# Altium schematic sheet Bluetooth.SchDoc
size A
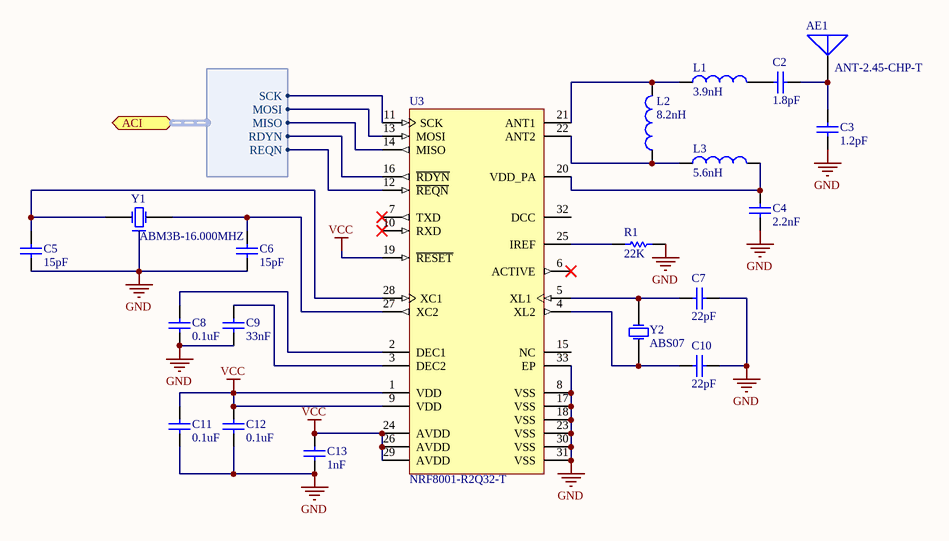
[diagram p0: Bluetooth.SchDoc]

## Parts
AE1  ANT-2.45-CHP-T  [ANT-2.45-CHP]
C2  value 1.8pF  [C0402[1005X55]]  (hidden comment: 1.8pF 50V 0402)
C3  value 1.2pF  [C0402[1005X55]]  (hidden comment: 1.2pF 50V 0402)
C4  value 2.2nF  [C0402[1005X55]]  (hidden comment: 2.2nF 50V 0402)
C5  value 15pF  [C0402[1005X55]]  (hidden comment: 15pF 50V 0402)
C6  value 15pF  [C0402[1005X55]]  (hidden comment: 15pF 50V 0402)
C7  value 22pF  [C0402[1005X55]]  (hidden comment: 22pF 50V 0402)
C8  value 0.1uF  [C0402[1005X55]]  (hidden comment: 0.1uF 6.3V 0402)
C9  value 33nF  [C0402[1005X55]]  (hidden comment: 33nF 50V 0402)
C10  value 22pF  [C0402[1005X55]]  (hidden comment: 22pF 50V 0402)
C11  value 0.1uF  [C0402[1005X55]]  (hidden comment: 0.1uF 6.3V 0402)
C12  value 0.1uF  [C0402[1005X55]]  (hidden comment: 0.1uF 6.3V 0402)
C13  value 1nF  [C0402[1005X55]]  (hidden comment: 1nF 50V 0402)
L1  3.9nH  [IND0402]
L2  8.2nH  [IND0402]
L3  5.6nH  [IND0402]
R1  value 22K  [R0402[1005]]  (hidden comment: 22K 1% 0402)
U3  NRF8001-R2Q32-T  [NRSC-QFN-32_M]
Y1  ABM3B-16.000MHZ  [ABRA-ABM3B-4_V]
Y2  ABS07  [ABS07]

## Ports
ACI (harness ACI)

## Harnesses
ACI: SCK, MISO, MOSI, RDYN, REQN

## Nets
GND: C3.1 C4.1 C5.1 C6.1 C7.2 C8.1 C9.1 C10.2 C11.1 C12.1 C13.1 R1.1 U3.8(VSS) U3.17(VSS) U3.18(VSS) U3.23(VSS) U3.30(VSS) U3.31(VSS) U3.33(EP) Y1.2
VCC: C11.2 C12.2 C13.2 U3.1(VDD) U3.9(VDD) U3.19(~{RESET}) U3.24(AVDD) U3.26(AVDD) U3.29(AVDD)
NetAE1_1: AE1.1 C2.2 C3.2
NetC2_1: C2.1 L1.2
NetC4_2: C4.2 L3.2 U3.20(VDD_PA)
NetC5_2: C5.2 U3.28(XC1) Y1.1(X1)
NetC6_2: C6.2 U3.27(XC2) Y1.3(X2)
NetC7_1: C7.1 U3.5(XL1) Y2.2(X2)
NetC8_2: C8.2 U3.2(DEC1)
NetC9_2: C9.2 U3.3(DEC2)
NetC10_1: C10.1 U3.4(XL2) Y2.1(X1)
NetL1_1: L1.1 L2.2 U3.21(ANT1)
NetL2_1: L2.1 L3.1 U3.22(ANT2)
NetR1_2: R1.2 U3.25(IREF)
NetU3_11: U3.11(SCK) ; port ACI.SCK
NetU3_12: U3.12(~{REQN}) ; port ACI.REQN
NetU3_13: U3.13(MOSI) ; port ACI.MOSI
NetU3_14: U3.14(MISO) ; port ACI.MISO
NetU3_16: U3.16(~{RDYN}) ; port ACI.RDYN

Not connected (* = marked no-connect by the designer): U3 6(ACTIVE)* 7(TXD)* 10(RXD)* 15(NC) 32(DCC)

## Library data of the parts
AE1 = ANT-2.45-CHP-T: Manufacturer: Taiyo Yuden; PartNumber: ANT-2.45-CHP-T; Mounting Technology: Surface Mount
C2 = CAP_1.8pF_50V_0402_0.05pF: 1.8pF 50V 0.05pF 0402 (1005 Metric); PartNumber: GRM1555C1H1R8WA01D; Manufacturer: Murata; Mounting Technology: Surface Mount; PackageReference: 0402; PackageDescription: 0402 (1005 Metric); Voltage: 50V; Tolerance: 0.05pF
C3 = CAP_1.2pF_50V_0402_0.05pF: 1.2pF 50V 0.05pF 0402 (1005 Metric); PartNumber: GRM1555C1H1R2WA01D; Manufacturer: Murata; Mounting Technology: Surface Mount; PackageReference: 0402; PackageDescription: 0402 (1005 Metric); Voltage: 50V; Tolerance: 0.05pF
C4 = CAP_2.2nF_50V_0402_10%: 2.2nF 50V 10% 0402 (1005 Metric); PartNumber: GCM155R71H222KA37D; Manufacturer: Murata; Mounting Technology: Surface Mount; PackageReference: 0402; PackageDescription: 0402 (1005 Metric); Voltage: 50V; Tolerance: 10%
C5 C6 = CAP_15pF_50V_0402_5%: 15pF 50V 5% 0402 (1005 Metric); PartNumber: GRM1555C1H150JA01D; Manufacturer: Murata; Mounting Technology: Surface Mount; PackageReference: 0402; PackageDescription: 0402 (1005 Metric); Voltage: 50V; Tolerance: 5%
C7 C10 = CAP_22pF_50V_0402_1%: 22pF 50V 1% 0402 (1005 Metric); PartNumber: GRM1555C1H220FA01D; Manufacturer: Murata; Mounting Technology: Surface Mount; PackageReference: 0402; PackageDescription: 0402 (1005 Metric); Voltage: 50V; Tolerance: 1%
C8 C11 C12 = CAP_0.1uF_6.3V_0402_10%: 0.1uF 6.3V 10% 0402 (1005 Metric); PartNumber: GRM155R70J104KA01D; Manufacturer: Murata; Mounting Technology: Surface Mount; PackageReference: 0402; PackageDescription: 0402 (1005 Metric); Voltage: 6.3V; Tolerance: 10%
C9 = CAP_33nF_50V_0402_10%: 33nF 50V 10% 0402 (1005 Metric); PartNumber: GRM155R71H333KE14D; Manufacturer: Murata; Mounting Technology: Surface Mount; PackageReference: 0402; PackageDescription: 0402 (1005 Metric); Voltage: 50V; Tolerance: 10%
C13 = CAP_1nF_50V_0402_5%: 1nF 50V 5% 0402 (1005 Metric); PartNumber: GRM1555C1H102JA01D; Manufacturer: Murata; Mounting Technology: Surface Mount; PackageReference: 0402; PackageDescription: 0402 (1005 Metric); Voltage: 50V; Tolerance: 5%
L1 = IND_3.9nH_0.3A_0402_0.3nH: 3.9nH +/-0.3nH 0.3A 0402; PartNumber: LQG15HS3N9S02D; Manufacturer: Murata; PackageReference: 0402; PackageDescription: 0402 (2012 metric); Mounting Technology: Surface Mount; Current: 0.3A; Value: 3.9nH
L2 = IND_8.2nH_0.3A_0402_5%: 8.2nH 5% 0.3A 0402; PartNumber: LQG15HS8N2J02D; Manufacturer: Murata; PackageReference: 0402; PackageDescription: 0402 (2012 metric); Mounting Technology: Surface Mount; Current: 0.3A; Value: 8.2nH
L3 = IND_5.6nH_0.3A_0402_0.3nH: 5.6nH +/-0.3nH 0.3A 0402; PartNumber: LQG15HS5N6S02D; Manufacturer: Murata; PackageReference: 0402; PackageDescription: 0402 (2012 metric); Mounting Technology: Surface Mount; Current: 0.3A; Value: 5.6nH
R1 = RES_22K_0402_1%: 22K 0.063W 1% 0402 (1005 Metric); Manufacturer: KOA Speer; PartNumber: RK73H1ETTP2202F; Tolerance: 1%; Power: 0.063W; Mounting Technology: Surface Mount; PackageReference: 0402; PackageDescription: 0402 (1005 Metric); ComponentLink1Description: Datasheet; ComponentLink1URL: http://www.koaspeer.com/catimages/Products/RK73H/RK73H.pdf
U3 = CMP-1763-00001-1: Single-Chip Bluetooth(R) Low Energy Solution, 1.9 to 3.6 V, -40 to 85 degC, 32-Pin QFN, RoHS, Tray; Case\Package: Radial; Voltage Rating: 50 V; Capacitance: 22 uF; Tolerance: 20%; DatasheetVersion: Rev. 1.1, 10/2012; ComponentLink1URL: http://www.nordicsemi.com/eng/Products/; Diameter: 5 mm; ComponentLink2URL: https://datasheet.ciiva.com/4914/nrf8001-ps-v-1-1-2797-4914162.pdf; Max Operating Temperature: 85 degC; Pins: 2; Package Quantity: 200; ComponentLink1Description: Manufacturer URL; Lead Pitch: 2 mm; RoHSCompliant: true; Voltage Rating (DC): 50 V; ComponentLink2Description: Datasheet; Length: 11 mm; Packaging: Bulk; Mount: Through Hole; REACH SVHC: No SVHC; PackageReference: QFN-32; PackageDescription: 32-Pin Quad Flat No-lead Package, Body 5 x 5 mm, Pitch 0.5 mm; Radiation Hardening: No; Height: 11 mm; Min Operating Temperature: -40 degC
Y1 = ABM3B-16.000MHZ-10-1-U-T: Manufacturer: ABRACON; PartNumber: ABM3B-16.000MHZ-10-1-U-T; Mounting Technology: Surface Mount; PackageReference: 2012; PackageDescription: 2012 (5032 metric)
Y2 = ABS07: Manufacturer: Abracon; PartNumber: ABS07-32.768KHZ-T; Mounting Technology: Surface Mount; PackageReference: 2-SMD